# EAGLE design Pure Power Strip (EAGLE 8.3.1)
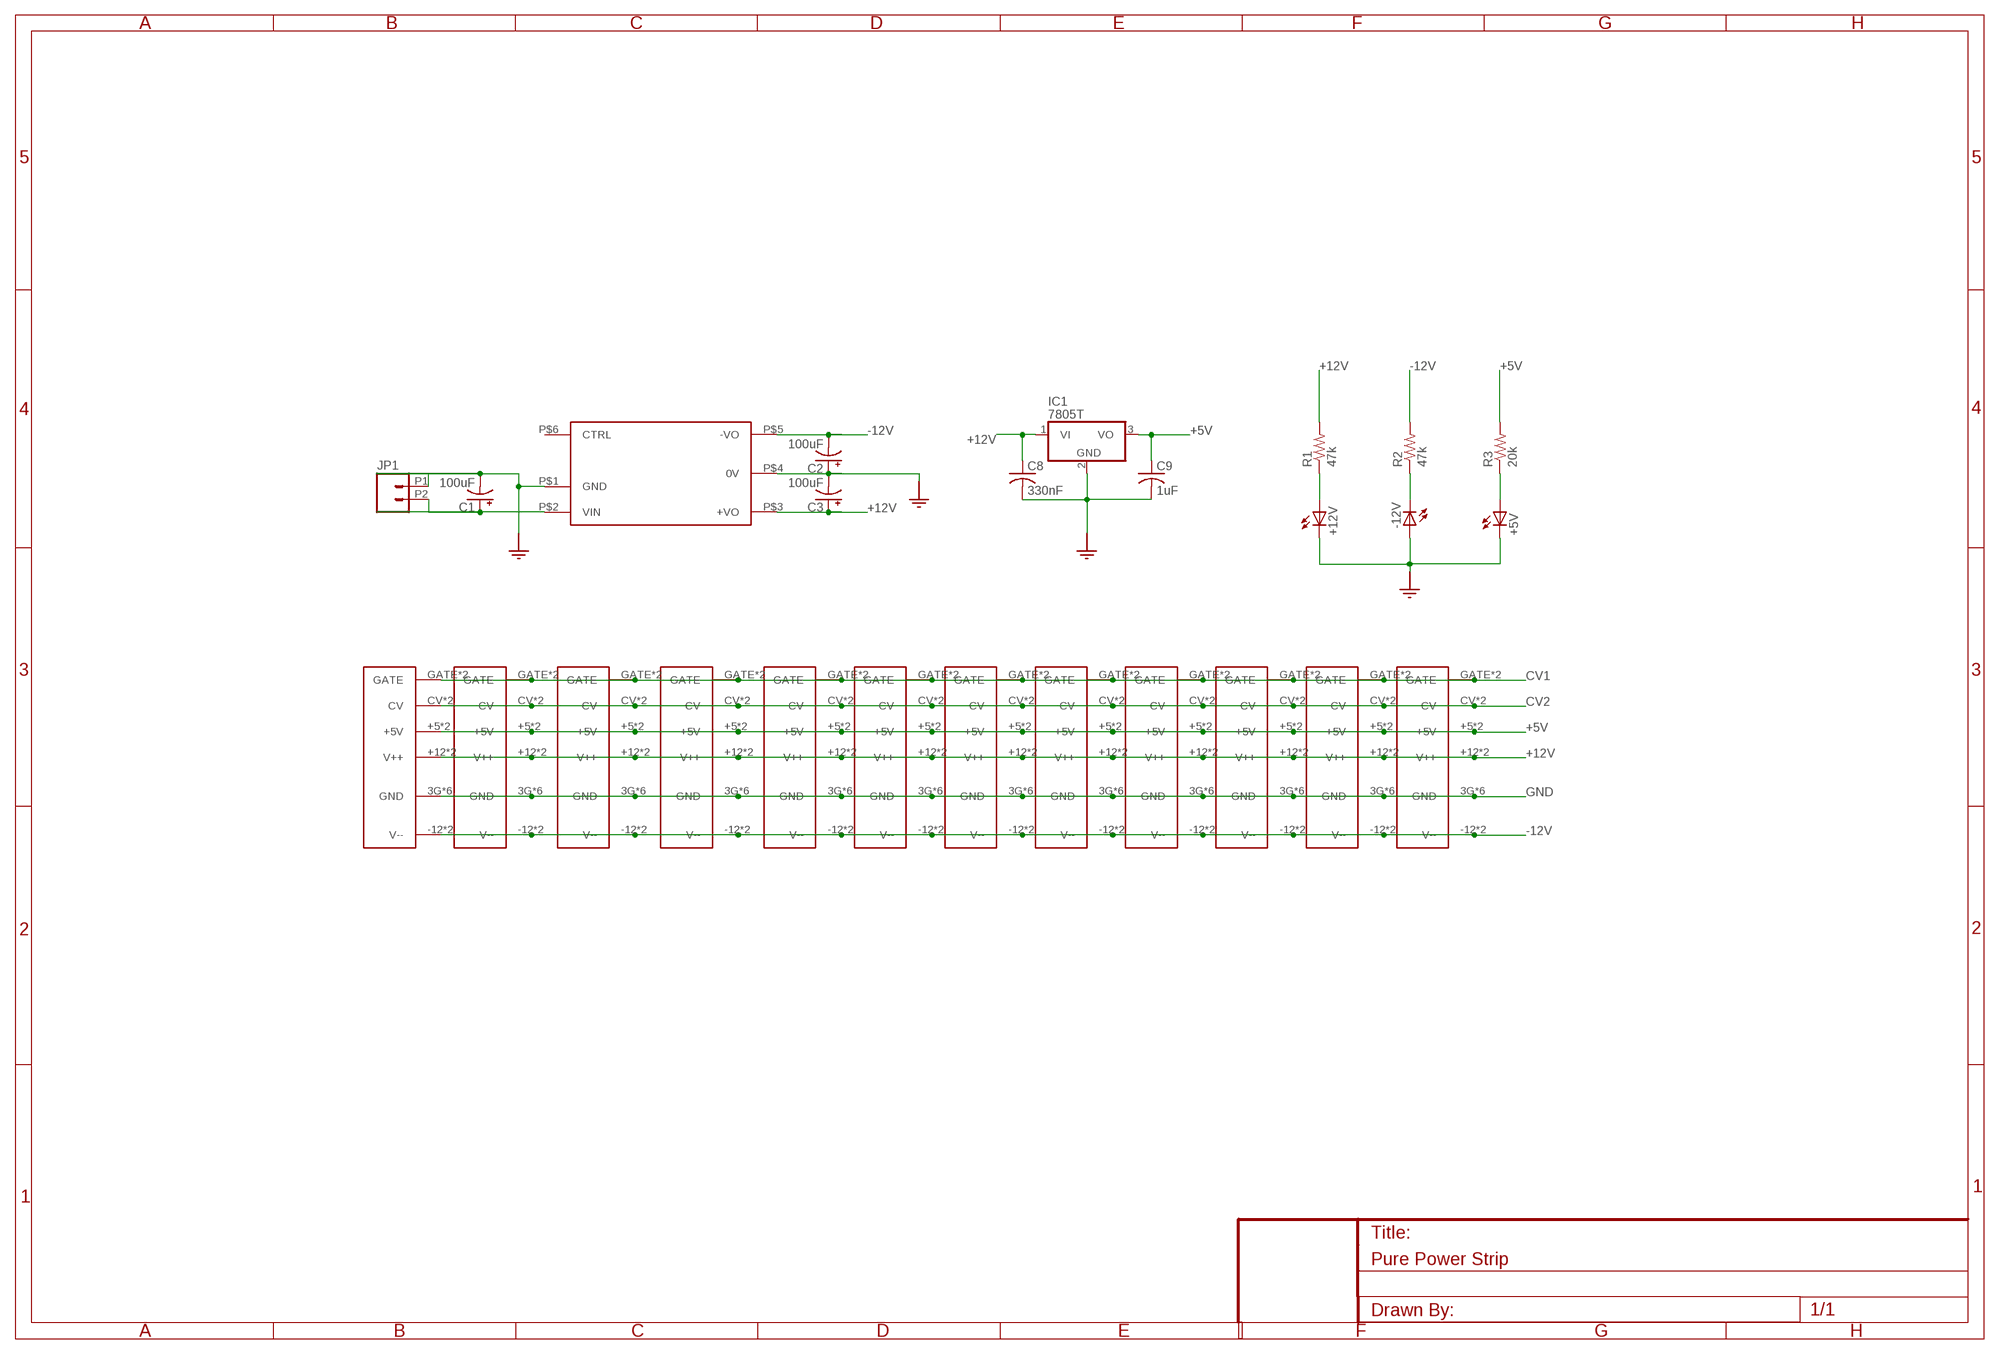
[diagram p0: schematic, sheet 1]

## Parts
+5V  LED5MM  [LED5MM]
+12V  LED5MM  [LED5MM]
-12V  LED5MM  [LED5MM]
C1  100uF  CPOL-USSANYO_D  [SANYO-OSCON_D]
C2  100uF  CPOL-USSANYO_D  [SANYO-OSCON_D]
C3  100uF  CPOL-USSANYO_D  [SANYO-OSCON_D]
C8  330nF  C-US025-024X044  [C025-024X044]
C9  1uF  C-US025-024X044  [C025-024X044]
IC1  7805T  [TO220H]
JP1  1X02_5MM_SCREWTERM  [1X02_5MM_SCREWTERM]
R1  47k  R-US_0207/10  [0207/10]
R2  47k  R-US_0207/10  [0207/10]
R3  20k  R-US_0207/10  [0207/10]
U$1  URA241XLD-20WR3  [URA241XLD-20WR3]
U$2  EURO_POWER_16  [POWER_SHROUDED]
U$3  EURO_POWER_16  [POWER_SHROUDED]
U$4  EURO_POWER_16  [POWER_SHROUDED]
U$5  EURO_POWER_16  [POWER_SHROUDED]
U$6  EURO_POWER_16  [POWER_SHROUDED]
U$7  EURO_POWER_16  [POWER_SHROUDED]
U$8  EURO_POWER_16  [POWER_SHROUDED]
U$9  EURO_POWER_16  [POWER_SHROUDED]
U$10  EURO_POWER_16  [POWER_SHROUDED]
U$11  EURO_POWER_16  [POWER_SHROUDED]
U$12  EURO_POWER_16  [POWER_SHROUDED]
U$13  EURO_POWER_16  [POWER_SHROUDED]

## Nets
+5V: C9.1 IC1.3(VO) R3.2 U$2.+5(+5V) U$2.+5A(+5V) U$3.+5(+5V) U$3.+5A(+5V) U$4.+5(+5V) U$4.+5A(+5V) U$5.+5(+5V) U$5.+5A(+5V) U$6.+5(+5V) U$6.+5A(+5V) U$7.+5(+5V) U$7.+5A(+5V) U$8.+5(+5V) U$8.+5A(+5V) U$9.+5(+5V) U$9.+5A(+5V) U$10.+5(+5V) U$10.+5A(+5V) U$11.+5(+5V) U$11.+5A(+5V) U$12.+5(+5V) U$12.+5A(+5V) U$13.+5(+5V) U$13.+5A(+5V)
+12V: C3.+ C8.1 IC1.1(VI) R1.2 U$1.P$3(+VO) U$2.+12(V++) U$2.+12A(V++) U$3.+12(V++) U$3.+12A(V++) U$4.+12(V++) U$4.+12A(V++) U$5.+12(V++) U$5.+12A(V++) U$6.+12(V++) U$6.+12A(V++) U$7.+12(V++) U$7.+12A(V++) U$8.+12(V++) U$8.+12A(V++) U$9.+12(V++) U$9.+12A(V++) U$10.+12(V++) U$10.+12A(V++) U$11.+12(V++) U$11.+12A(V++) U$12.+12(V++) U$12.+12A(V++) U$13.+12(V++) U$13.+12A(V++)
-12V: C2.- R2.2 U$1.P$5(-VO) U$2.-12(V--) U$2.-12A(V--) U$3.-12(V--) U$3.-12A(V--) U$4.-12(V--) U$4.-12A(V--) U$5.-12(V--) U$5.-12A(V--) U$6.-12(V--) U$6.-12A(V--) U$7.-12(V--) U$7.-12A(V--) U$8.-12(V--) U$8.-12A(V--) U$9.-12(V--) U$9.-12A(V--) U$10.-12(V--) U$10.-12A(V--) U$11.-12(V--) U$11.-12A(V--) U$12.-12(V--) U$12.-12A(V--) U$13.-12(V--) U$13.-12A(V--)
CV1: U$2.GATE U$2.GATEA(GATE) U$3.GATE U$3.GATEA(GATE) U$4.GATE U$4.GATEA(GATE) U$5.GATE U$5.GATEA(GATE) U$6.GATE U$6.GATEA(GATE) U$7.GATE U$7.GATEA(GATE) U$8.GATE U$8.GATEA(GATE) U$9.GATE U$9.GATEA(GATE) U$10.GATE U$10.GATEA(GATE) U$11.GATE U$11.GATEA(GATE) U$12.GATE U$12.GATEA(GATE) U$13.GATE U$13.GATEA(GATE)
CV2: U$2.CV U$2.CVA(CV) U$3.CV U$3.CVA(CV) U$4.CV U$4.CVA(CV) U$5.CV U$5.CVA(CV) U$6.CV U$6.CVA(CV) U$7.CV U$7.CVA(CV) U$8.CV U$8.CVA(CV) U$9.CV U$9.CVA(CV) U$10.CV U$10.CVA(CV) U$11.CV U$11.CVA(CV) U$12.CV U$12.CVA(CV) U$13.CV U$13.CVA(CV)
GND: +5V.K(C) +12V.K(C) -12V.A C1.- C2.+ C3.- C8.2 C9.2 IC1.2(GND) JP1.P1 U$1.P$1(GND) U$1.P$4(0V) U$2.3G(GND) U$2.4G(GND) U$2.5G(GND) U$2.6G(GND) U$2.7G(GND) U$2.8G(GND) U$3.3G(GND) U$3.4G(GND) U$3.5G(GND) U$3.6G(GND) U$3.7G(GND) U$3.8G(GND) U$4.3G(GND) U$4.4G(GND) U$4.5G(GND) U$4.6G(GND) U$4.7G(GND) U$4.8G(GND) U$5.3G(GND) U$5.4G(GND) U$5.5G(GND) U$5.6G(GND) U$5.7G(GND) U$5.8G(GND) U$6.3G(GND) U$6.4G(GND) U$6.5G(GND) U$6.6G(GND) U$6.7G(GND) U$6.8G(GND) U$7.3G(GND) U$7.4G(GND) U$7.5G(GND) U$7.6G(GND) U$7.7G(GND) U$7.8G(GND) U$8.3G(GND) U$8.4G(GND) U$8.5G(GND) U$8.6G(GND) U$8.7G(GND) U$8.8G(GND) U$9.3G(GND) U$9.4G(GND) U$9.5G(GND) U$9.6G(GND) U$9.7G(GND) U$9.8G(GND) U$10.3G(GND) U$10.4G(GND) U$10.5G(GND) U$10.6G(GND) U$10.7G(GND) U$10.8G(GND) U$11.3G(GND) U$11.4G(GND) U$11.5G(GND) U$11.6G(GND) U$11.7G(GND) U$11.8G(GND) U$12.3G(GND) U$12.4G(GND) U$12.5G(GND) U$12.6G(GND) U$12.7G(GND) U$12.8G(GND) U$13.3G(GND) U$13.4G(GND) U$13.5G(GND) U$13.6G(GND) U$13.7G(GND) U$13.8G(GND)
N$3: C1.+ JP1.P2 U$1.P$2(VIN)
N$4: +12V.A R1.1
N$5: -12V.K(C) R2.1
N$6: +5V.A R3.1
Unconnected: U$1.P$6(CTRL)

## Library data of the parts
+5V +12V -12V = GMSN:LED: LED OSRAM: - CHIPLED LG R971, LG N971, LY N971, LG Q971, LY Q971, LO R971, LY R971 LH N974, LH R974 LS Q976, LO Q976, LY Q976 LO Q996 - Hyper CHIPLED LW Q18S LB Q993, LB Q99A, LB R99A - SideLED LS A670, LO A670, LY A670, LG A670, LP A670 LB A673, LV A673, LT A673, LW A673 LH A674 LY A675 LS A676, LA A676, LO A676, LY A676, LW A676 LS A679, LY A679, LG A679 - Hyper Micro SIDELED® LS Y876, LA Y876, LO Y876, LY Y876 LT Y87S - SmartLED LW L88C, LW L88S LB L89C, LB L89S, LG L890 LS L89K, LO L89K, LY L89K LS L896, LA L896, LO L896, LY L896 - TOPLED LS T670, LO T670, LY T670, LG T670, LP T670 LSG T670, LSP T670, LSY T670, LOP T670, LYG T670 LG T671, LOG T671, LSG T671 LB T673, LV T673, LT T673, LW T673 LH T674 LS T676, LA T676, LO T676, LY T676, LB T676, LH T676, LSB T676, LW T676 LB T67C, LV T67C, LT T67C, LS T67K, LO T67K, LY T67K, LW E67C LS E67B, LA E67B, LO E67B, LY E67B, LB E67C, LV E67C, LT E67C LW T67C LS T679, LY T679, LG T679 LS T770, LO T770, LY T770, LG T770, LP T770 LB T773, LV T773, LT T773, LW T773 LH T774 LS E675, LA E675, LY E675, LS T675 LS T776, LA T776, LO T776, LY T776, LB T776 LHGB T686 LT T68C, LB T68C - Hyper Mini TOPLED® LB M676 - Mini TOPLED Santana® LG M470 LS M47K, LO M47K, LY M47K Source: http://www.osram.convergy.de/
C1-C3 = GMSN:CPOL-US: POLARIZED CAPACITOR, American symbol
C8 C9 = GMSN:C-US: CAPACITOR, American symbol
IC1 = GMSN:78*: Positive VOLTAGE REGULATOR Added bigger pads to the TO-92 package
JP1 = GMSN:1X02_5MM_SCREWTERM
R1-R3 = GMSN:R-US_: RESISTOR, American symbol
U$1 = GMSN:URA241XLD-20WR3
U$2-U$13 = GMSN:EURO_POWER_16

## Board
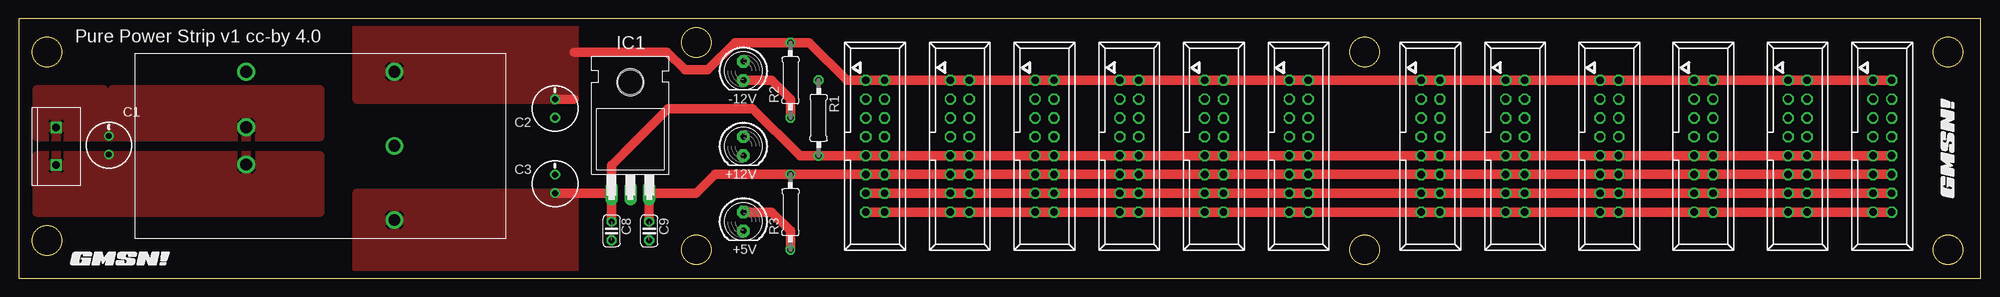
[diagram p1: board, top side]
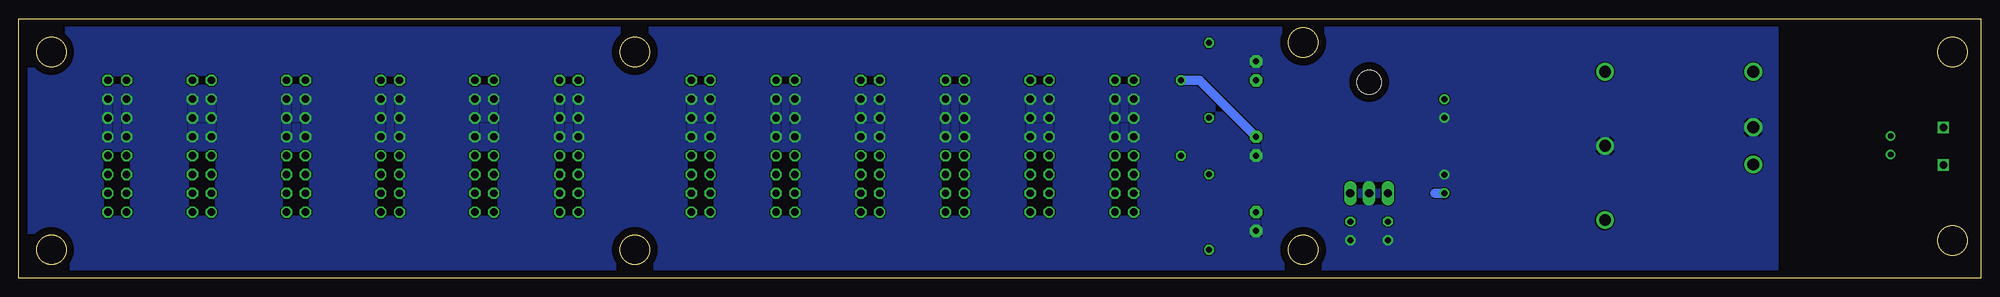
[diagram p2: board, bottom side, seen from below]

Size 264.77 x 35 mm. Coordinates in mm from the lower left corner, seen from the top.
Outline: 0,0 264.77,0 264.77,35 0,35 0,0
Outline: circle at 3.81,30.48 radius 2
Outline: circle at 3.81,5.08 radius 2
Outline: circle at 260.35,30.48 radius 2
Outline: circle at 260.35,3.81 radius 2
Outline: circle at 91.44,31.75 radius 2
Outline: circle at 91.44,3.81 radius 2
Outline: circle at 181.61,30.48 radius 2
Outline: circle at 181.61,3.81 radius 2
Copper layers (1*16): Top 0.035mm / dielectric 1.5mm / Bottom 0.035mm
Design rules "default": minimum track width 6mil, minimum drill 0.35mm, track to track 6mil, track to pad 6mil, pad to pad 6mil, via to via 6mil, smd to smd 6mil, copper to edge 40mil, drill to drill 6mil, minimum pad ring 10mil, minimum via ring 8mil, stop-mask expansion 4mil, vias tented up to drill 0mil, thermal gap 10mil

### Footprints (pad centres in the part's own frame; a part is rotated, then mirrored left to right if it is on the bottom)
LED5MM = drill 0.813 pad 1.676 octagon: A -1.27,0; K 1.27,0
SANYO-OSCON_D = drill 0.8 pad 1.27: + 1.25,0; - -1.25,0
C025-024X044 = drill 0.813 octagon: 1 -1.27,0; 2 1.27,0
TO220H = drill 1.118 long: 1 -2.54,-10.16; 2 0,-10.16; 3 2.54,-10.16 | hole 3.302: 0,4.826
1X02_5MM_SCREWTERM = drill 1.016 square: P1 5.08,0; P2 0,0
0207/10 = drill 0.813 octagon: 1 -5.08,0; 2 5.08,0
URA241XLD-20WR3 = drill 1.6: P$1 -15,0; P$2 -15,-5; P$3 5,-12.5; P$4 5,-2.5; P$5 5,7.5; P$6 -15,7.5
POWER_SHROUDED = drill 1 octagon: 3G -6.35,-1.27; 4G -6.35,1.27; 5G -3.81,-1.27; 6G -3.81,1.27; 7G -1.27,-1.27; 8G -1.27,1.27; +5 3.81,-1.27; +5A 3.81,1.27; +12 1.27,-1.27; +12A 1.27,1.27; -12 -8.89,-1.27; -12A -8.89,1.27; CV 6.35,-1.27; CVA 6.35,1.27; GATE 8.89,-1.27; GATEA 8.89,1.27

### Placement (x,y rotation side)
+5V  97.79,7.62 270 top
+12V  97.79,17.78 270 top
-12V  97.79,27.94 270 top
C1  12.19,17.91 270 top
C2  72.39,22.86 270 top
C3  72.39,12.7 270 top
C8  80.01,6.35 270 top
C9  85.09,6.35 270 top
IC1  82.55,21.59 0 top
JP1  5.08,15.24 90 top
R1  107.95,21.59 270 top
R2  104.14,26.67 90 top
R3  104.14,8.89 90 top
U$1  45.72,20.32 0 top
U$2  127,17.78 270 top
U$3  138.43,17.78 270 top
U$4  149.86,17.78 270 top
U$5  161.29,17.78 270 top
U$6  172.72,17.78 270 top
U$7  190.5,17.78 270 top
U$8  201.93,17.78 270 top
U$9  214.63,17.78 270 top
U$10  227.33,17.78 270 top
U$11  115.57,17.78 270 top
U$12  240.03,17.78 270 top
U$13  251.46,17.78 270 top
U$14  [GMSN!_LOGO]  260.35,17.78 90 top
U$15  [GMSN!_LOGO]  13.97,2.54 0 top

### Tracks (layer width: path | path; a pad name or v marks a point on that pad's centre or on a via)
+5V
  Top 1.27: C9.1 IC1.3 91.44,11.43 93.98,13.97 R3.2 U$11.+5 U$11.+5A U$2.+5 U$2.+5A U$3.+5 U$3.+5A U$4.+5 U$4.+5A U$5.+5 U$5.+5A U$6.+5 U$6.+5A U$7.+5 U$7.+5A | U$7.+5A 187.96,13.97 U$7.+5A | U$7.+5A U$8.+5 | U$8.+5 198.12,13.97 U$8.+5 | U$8.+5 U$8.+5A U$9.+5 U$9.+5A U$10.+5 U$10.+5A U$12.+5 U$12.+5A U$13.+5 U$13.+5A
+12V
  Top 1.27: C3.+ 72.41,11.43 IC1.1 | C8.1 IC1.1 | U$4.+12A U$5.+12 U$5.+12A U$6.+12 U$6.+12A U$7.+12 U$7.+12A U$8.+12 U$8.+12A U$9.+12 U$9.+12A U$10.+12 U$10.+12A U$12.+12 U$12.+12A U$13.+12 U$13.+12A | U$4.+12A 149.86,16.51 U$4.+12A | U$4.+12A U$4.+12 U$3.+12A U$3.+12 U$2.+12A U$2.+12 U$11.+12A U$11.+12 R1.2 105.41,16.51 99.06,22.86 87.63,22.86 80.01,15.24 IC1.1
  Bottom 1.27: 73.66,11.43 72.39,11.43 C3.+
  pour Top: 45.72,11.43 74.93,11.43 74.93,1.27 45.72,1.27
-12V
  Top 1.27: 74.93,24.13 72.41,24.13 C2.- | U$4.-12 U$3.-12A U$3.-12 U$2.-12A U$2.-12 U$11.-12A U$11.-12 111.76,26.67 106.68,31.75 R2.2 96.66,31.75 92.97,28.06 89.91,28.06 87.49,30.48 74.93,30.48 | U$4.-12 149.86,26.67 U$4.-12 | U$4.-12 U$4.-12A U$5.-12 U$5.-12A U$6.-12 U$6.-12A U$7.-12 U$7.-12A U$8.-12 U$8.-12A U$9.-12 U$9.-12A U$10.-12 U$10.-12A U$12.-12 U$12.-12A U$13.-12 U$13.-12A
  pour Top: 74.93,34.29 74.93,24.13 45.72,24.13 45.72,34.29
CV1
  Top 1.27: U$11.GATE U$11.GATEA U$2.GATE U$2.GATEA U$3.GATE U$3.GATEA U$4.GATE U$4.GATEA U$5.GATE U$5.GATEA U$6.GATE U$6.GATEA U$7.GATE U$7.GATEA U$8.GATE U$8.GATEA U$9.GATE U$9.GATEA U$10.GATE U$10.GATEA U$12.GATE U$12.GATEA U$13.GATE U$13.GATEA
CV2
  Top 1.27: U$11.CV U$11.CVA U$2.CV U$2.CVA U$3.CV U$3.CVA U$4.CV U$4.CVA U$5.CV U$5.CVA U$6.CV U$6.CVA U$7.CV U$7.CVA U$8.CV U$8.CVA U$9.CV U$9.CVA U$10.CV U$10.CVA U$12.CV U$12.CVA U$13.CV U$13.CVA
GND
  pour Top: 40.64,25.4 40.64,19.05 2.54,19.05 2.54,25.4 11.43,25.4 11.43,20.7 12.7,20.7 12.7,25.4
  pour Bottom: 27.94,35.56 262.89,35.56 262.89,0 27.94,0
N$3
  pour Top: 40.64,8.89 40.64,16.51 2.54,16.51 2.54,8.89
N$4
  Bottom 1.27: R1.1 105.41,26.67 +12V.A
N$5
  Top 1.27: -12V.K 101.6,26.67 104.14,24.13 R2.1
N$6
  Top 1.27: +5V.A 101.6,8.89 104.14,6.35 R3.1

### Text on the board
tNames: Pure Power Strip v1 cc-by 4.0